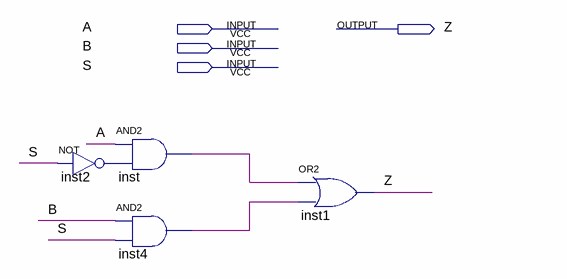
[diagram p0: schematic sheet]
// Quartus schematic MUX1BIT.bdf as structural Verilog: 4 symbols, 4 pins
module MUX1BIT (
  input  A,
  input  B,
  input  S,
  output Z
);

  wire inst2_out, inst4_out, inst_out;

  not inst2 (inst2_out, S);
  and inst (inst_out, A, inst2_out);
  and inst4 (inst4_out, B, S);
  or inst1 (Z, inst_out, inst4_out);
endmodule
